# EAGLE design eeZee_tiny (EAGLE 6.4)
DATABASE: ./../../../EAGLE/PARTSDB.TXT
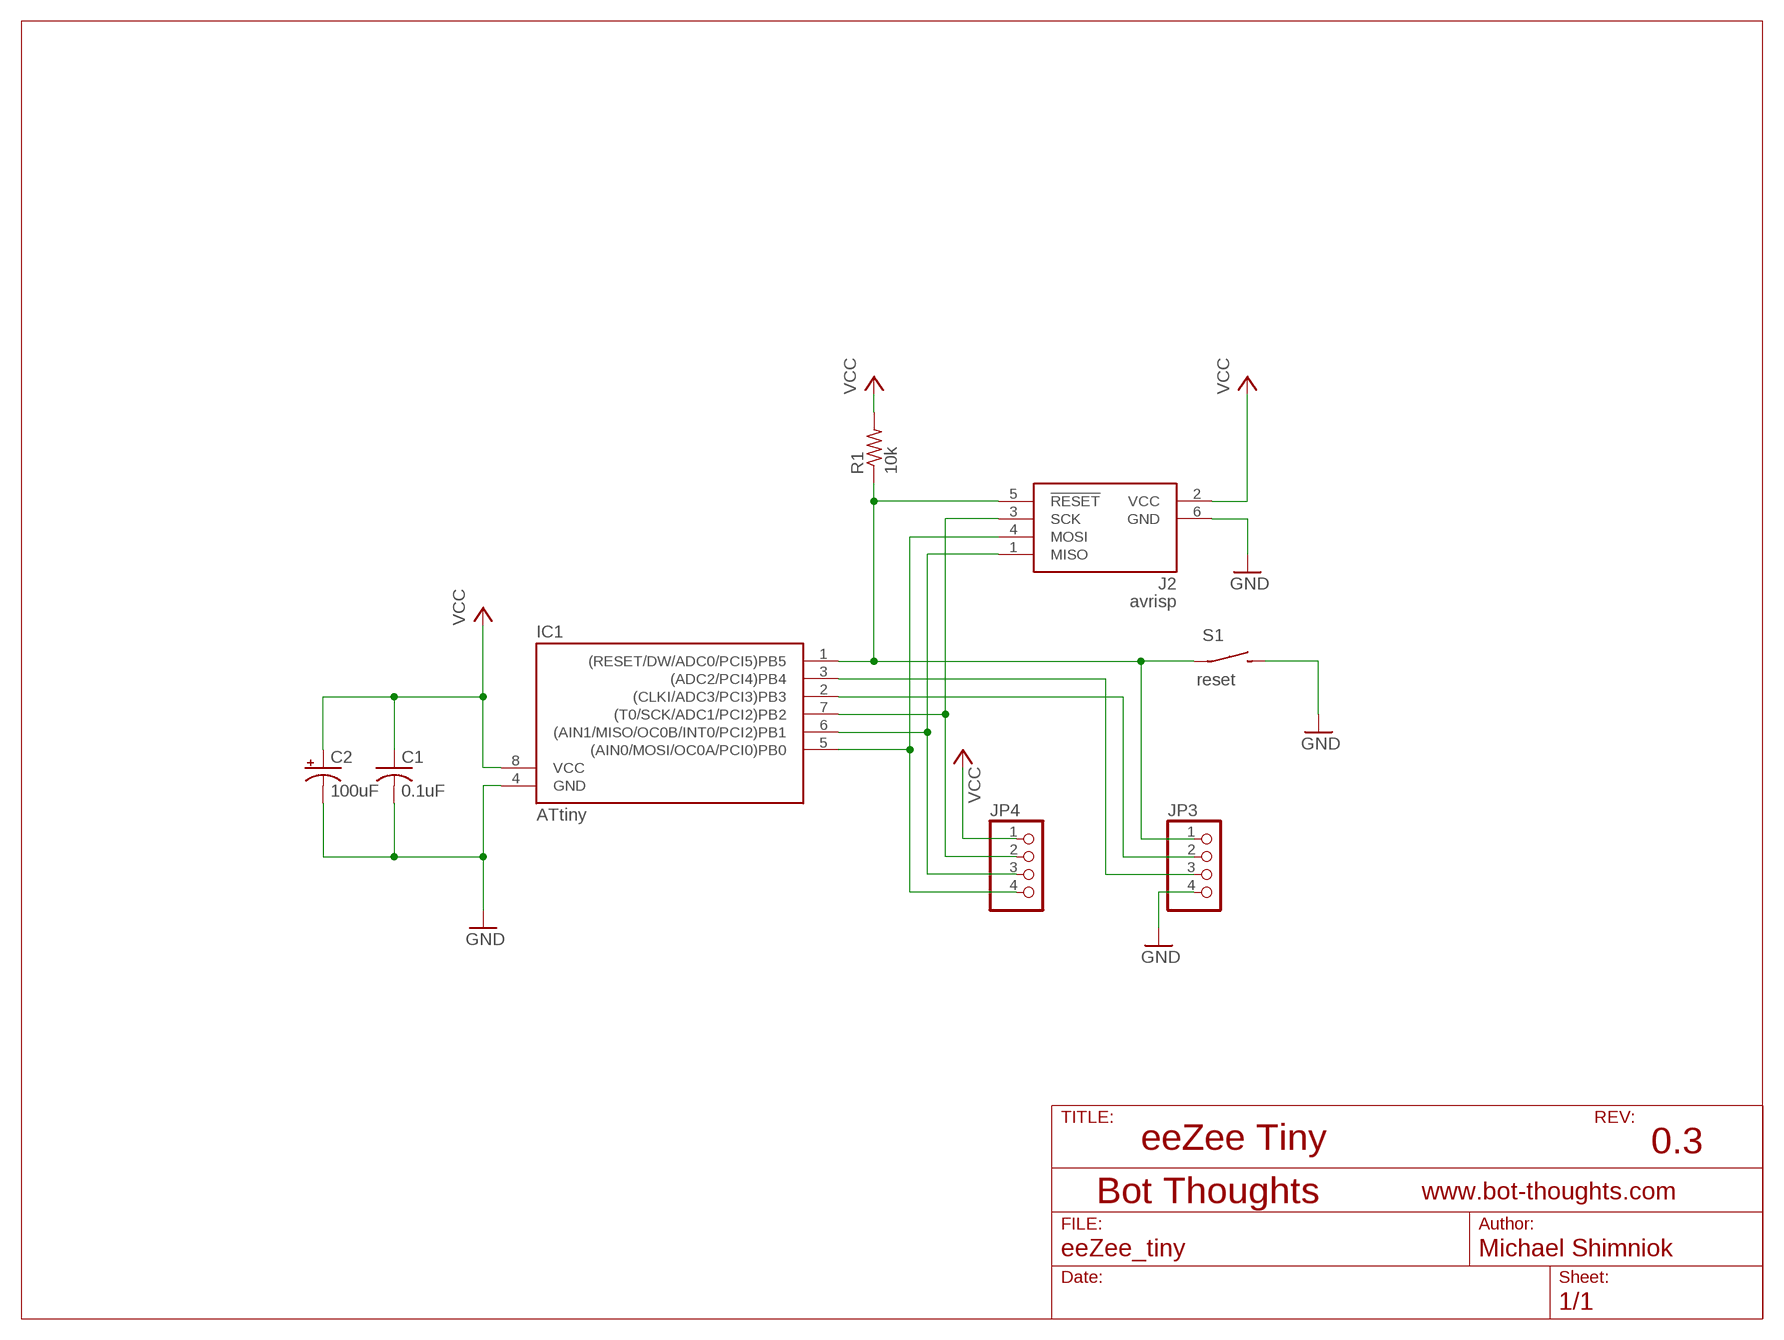
[diagram p0: schematic, sheet 1]

## Parts
C1  0.1uF  C-USC0603  [C0603]
C2  100uF  CAP_POL_SMC_B  [SMC_B]
IC1  ATtiny  ATTINY13-20P  [DIL08]
J2  avrisp  AVRISP6  [CON6P2R]
JP3  PINHD-1X04_2.54-S  [1X04-S]
JP4  PINHD-1X04_2.54-S  [1X04-S]
R1  10k  R-US_R0603  [R0603]
S1  reset  SPST_TAC_RECT1  [6MMTACTILE_RECT]

## Nets
!RESET: IC1.1((RESET/DW/ADC0/PCI5)PB5) J2.5(!RESET) JP3.1 R1.1 S1.P$1(P)
GND: C1.2 C2.- IC1.4(GND) J2.6(GND) JP3.4 S1.P$2(S)
MISO: IC1.6((AIN1/MISO/OC0B/INT0/PCI2)PB1) J2.1(MISO) JP4.3
MOSI: IC1.5((AIN0/MOSI/OC0A/PCI0)PB0) J2.4(MOSI) JP4.4
N$2: IC1.2((CLKI/ADC3/PCI3)PB3) JP3.2
N$8: IC1.3((ADC2/PCI4)PB4) JP3.3
SCK: IC1.7((T0/SCK/ADC1/PCI2)PB2) J2.3(SCK) JP4.2
VCC: C1.1 C2.+ IC1.8(VCC) J2.2(VCC) JP4.1 R1.2

## Notes on the sheet
- eeZee Tiny | 0.3

## Library data of the parts
C1 = rcl:C-US: CAPACITOR, American symbol; BOM: EXCLUDE; PARTNO: 0603YC104KAT2A
C2 = mes_rcl:CAP_POL: Capacitor, Polarized, American symbol; BOM: INCLUDE; PARTNO: F930J107MBA
IC1 = avr:ATTINY13: MICROCONTROLLER 1 Kbytes FLASH 64 bytes EEPROM 64 bytes RAM 4-channel 10 bit ADC; PARTNO: A08-LC-TT-R
J2 = ads4:AVRISP6: 6-pin dual-row connector for Atmel AVRISP programmer interface
JP3 JP4 = pinhead-2:PINHD-1X04: PIN HEADER
R1 = rcl:R-US_: RESISTOR, American symbol; PARTNO: ERJ-3GEYJ103V
S1 = mes_electromech:SPST: SPST SWITCH

## Board
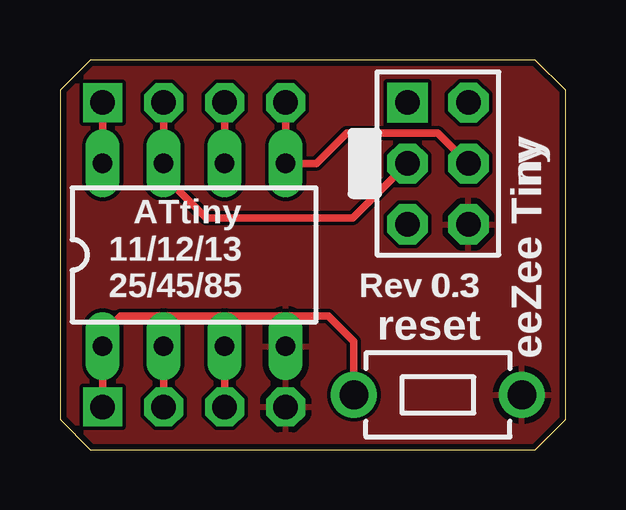
[diagram p1: board, top side]
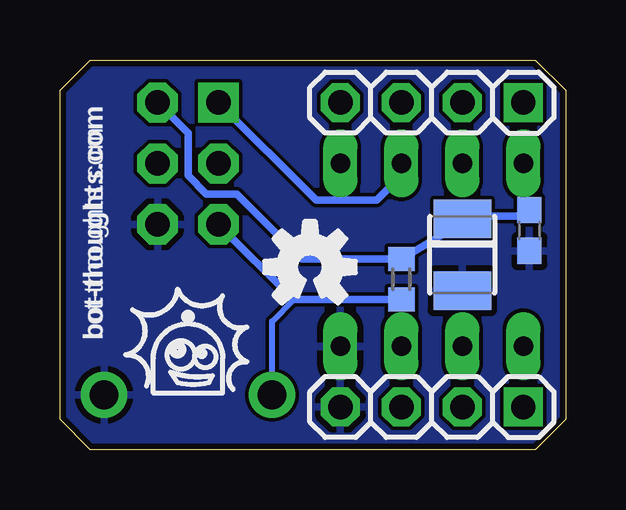
[diagram p2: board, bottom side, seen from below]

Size 21.08 x 16.26 mm. Coordinates in mm from the lower left corner, seen from the top.
Outline: 0,14.99 0,1.27 1.27,0 19.81,0 21.08,1.27 21.08,14.99 19.81,16.26 1.27,16.26 0,14.99
Copper layers (1*16): Top 0.0356mm / dielectric 1.5011mm / Bottom 0.0356mm
Design rules "LaenPCBOrder *": minimum track width 6mil, minimum drill 13mil, track to track 6mil, track to pad 6mil, pad to pad 6mil, via to via 6mil, smd to smd 6mil, copper to edge 10mil, drill to drill 6mil, minimum pad ring 12mil, minimum via ring 7mil, stop-mask expansion 4mil, vias tented up to drill 20mil, thermal gap 10mil

### Footprints (pad centres in the part's own frame; a part is rotated, then mirrored left to right if it is on the bottom)
C0603 = smd 1.1 x 1: 1 -0.85,0; 2 0.85,0
SMC_B = smd 1.6 x 2.4: + -1.5,0; - 1.5,0
DIL08 = drill 0.813 long: 1 -3.81,-3.81; 2 -1.27,-3.81; 3 1.27,-3.81; 4 3.81,-3.81; 5 3.81,3.81; 6 1.27,3.81; 7 -1.27,3.81; 8 -3.81,3.81
CON6P2R = drill 1.016 pad 1.676 square: 1 -2.54,-1.27 | drill 1.016 pad 1.676 octagon: 2 -2.54,1.27; 3 0,-1.27; 4 0,1.27; 5 2.54,-1.27; 6 2.54,1.27
1X04-S = drill 1.016 square: 1 -3.81,0 | drill 1.016 octagon: 2 -1.27,0; 3 1.27,0; 4 3.81,0
R0603 = smd 1 x 1.1: 1 -0.85,0; 2 0.85,0
6MMTACTILE_RECT = drill 1.2: P$1 -3.5,0; P$2 3.5,0

### Placement (x,y rotation side)
C1  1.52,9.14 270 bottom
C2  4.32,8.13 270 bottom
IC1  5.59,8.13 0 top
J2  15.75,11.94 270 top
JP3  5.59,1.78 180 bottom
JP4  5.59,14.48 180 bottom
R1  6.86,7.11 90 bottom
S1  15.75,2.29 0 top

### Tracks (layer width: path | path; a pad name or v marks a point on that pad's centre or on a via)
!RESET
  Top 0.305: JP3.1 IC1.1 1.78,4.83 2.54,5.59 11.18,5.59 12.25,4.52 S1.P$1
  Bottom 0.254: S1.P$1 12.25,5.36 11.34,6.26
  Bottom 0.305: J2.5 11.34,6.26 R1.1
GND
  pour Bottom: 0,16.26 22.1,16.26 22.1,0 0,0
  pour Top: 0,16.26 21.08,16.26 21.08,0 0,0
MISO
  Top 0.305: IC1.6 JP4.3
  Bottom 0.305: IC1.6 6.86,11.43 7.87,10.41 10.41,10.41 J2.1
MOSI
  Top 0.305: JP4.4 IC1.5 10.67,11.94 11.94,13.21 15.75,13.21 J2.4
N$2
  Top 0.305: JP3.2 IC1.2
N$8
  Top 0.305: JP3.3 IC1.3
SCK
  Top 0.305: JP4.2 IC1.7 4.32,11.43 6.1,9.65 12.19,9.65 J2.3
VCC
  Top 0.305: IC1.8 JP4.1
  Bottom 0.305: IC1.8 1.78,9.74 | 1.78,9.74 C1.1 | J2.2 15.75,13.21 15.75,11.43 14.99,10.67 13.72,10.67 11.01,7.96 R1.2 4.71,9.23 C2.+ 4.21,9.74 1.78,9.74

### Text on the board
tNames: 11/12/13 | 25/45/85 | Rev 0.3 | eeZee Tiny
bNames: bot-thoughts.com
_tsilk: ATtiny | 11/12/13 | 25/45/85 | Rev 0.3 | reset | eeZee Tiny
_bsilk: bot-thoughts.com